# EAGLE schematic light_controller (EAGLE 8.5.0)
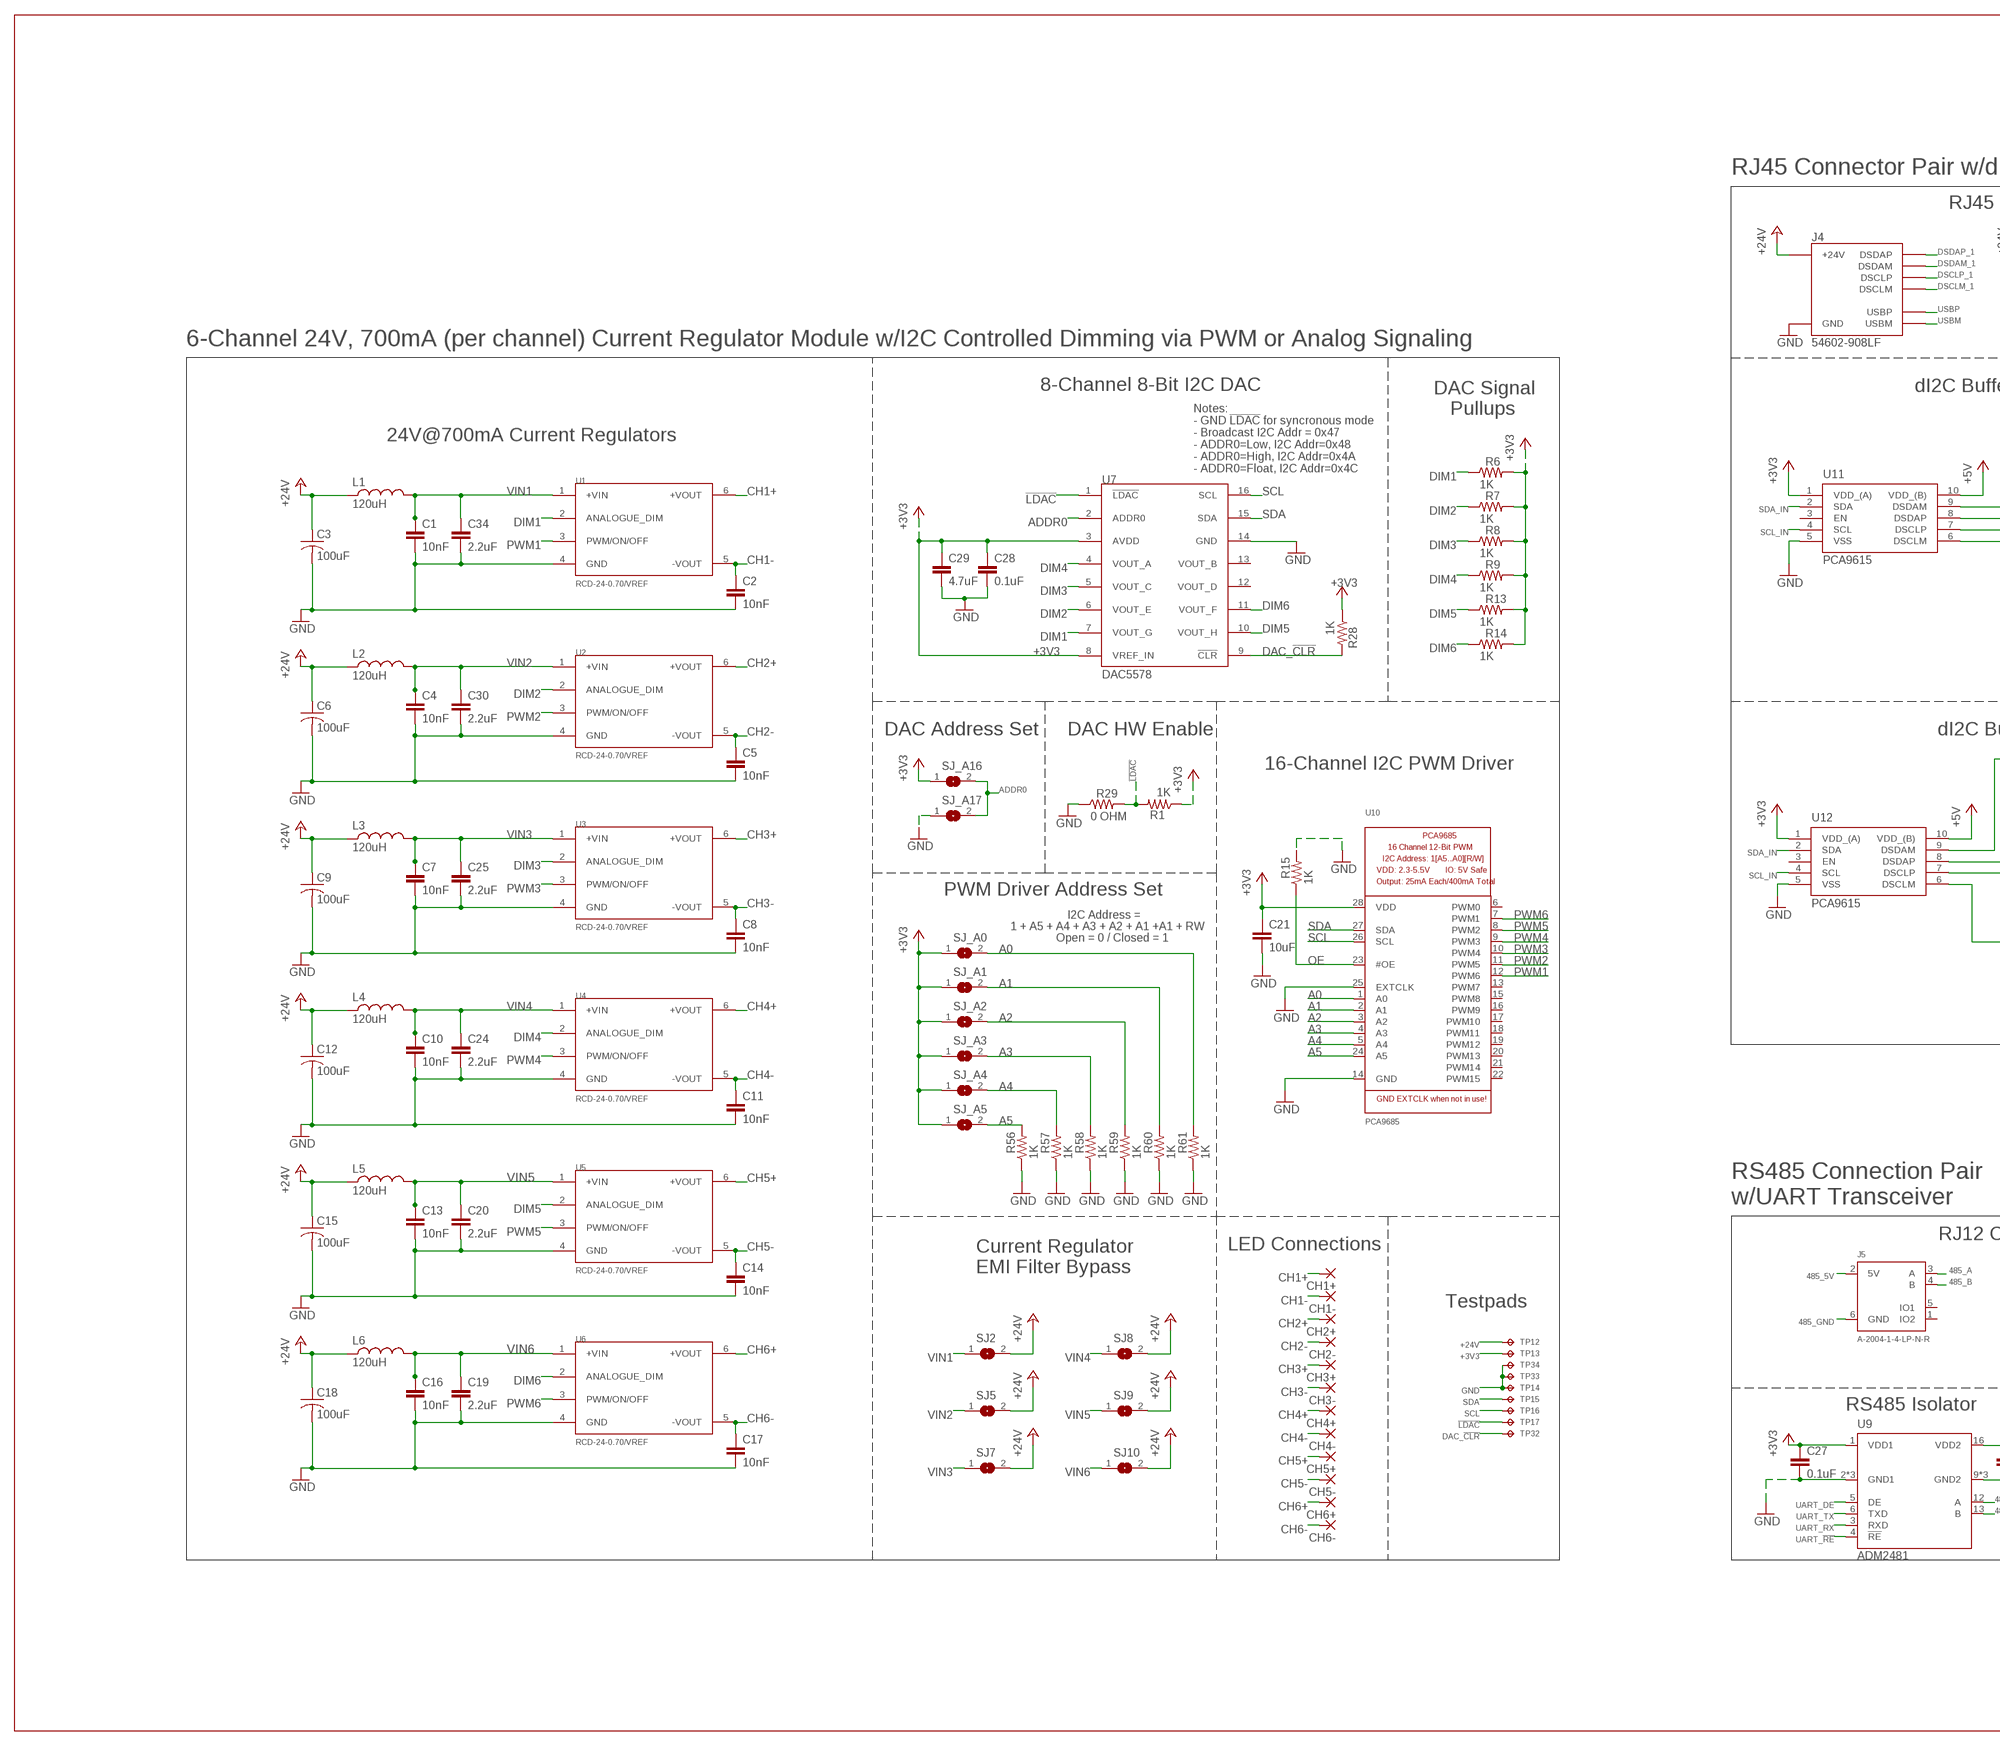
[diagram p0: schematic, sheet 1, part 1 of 2]
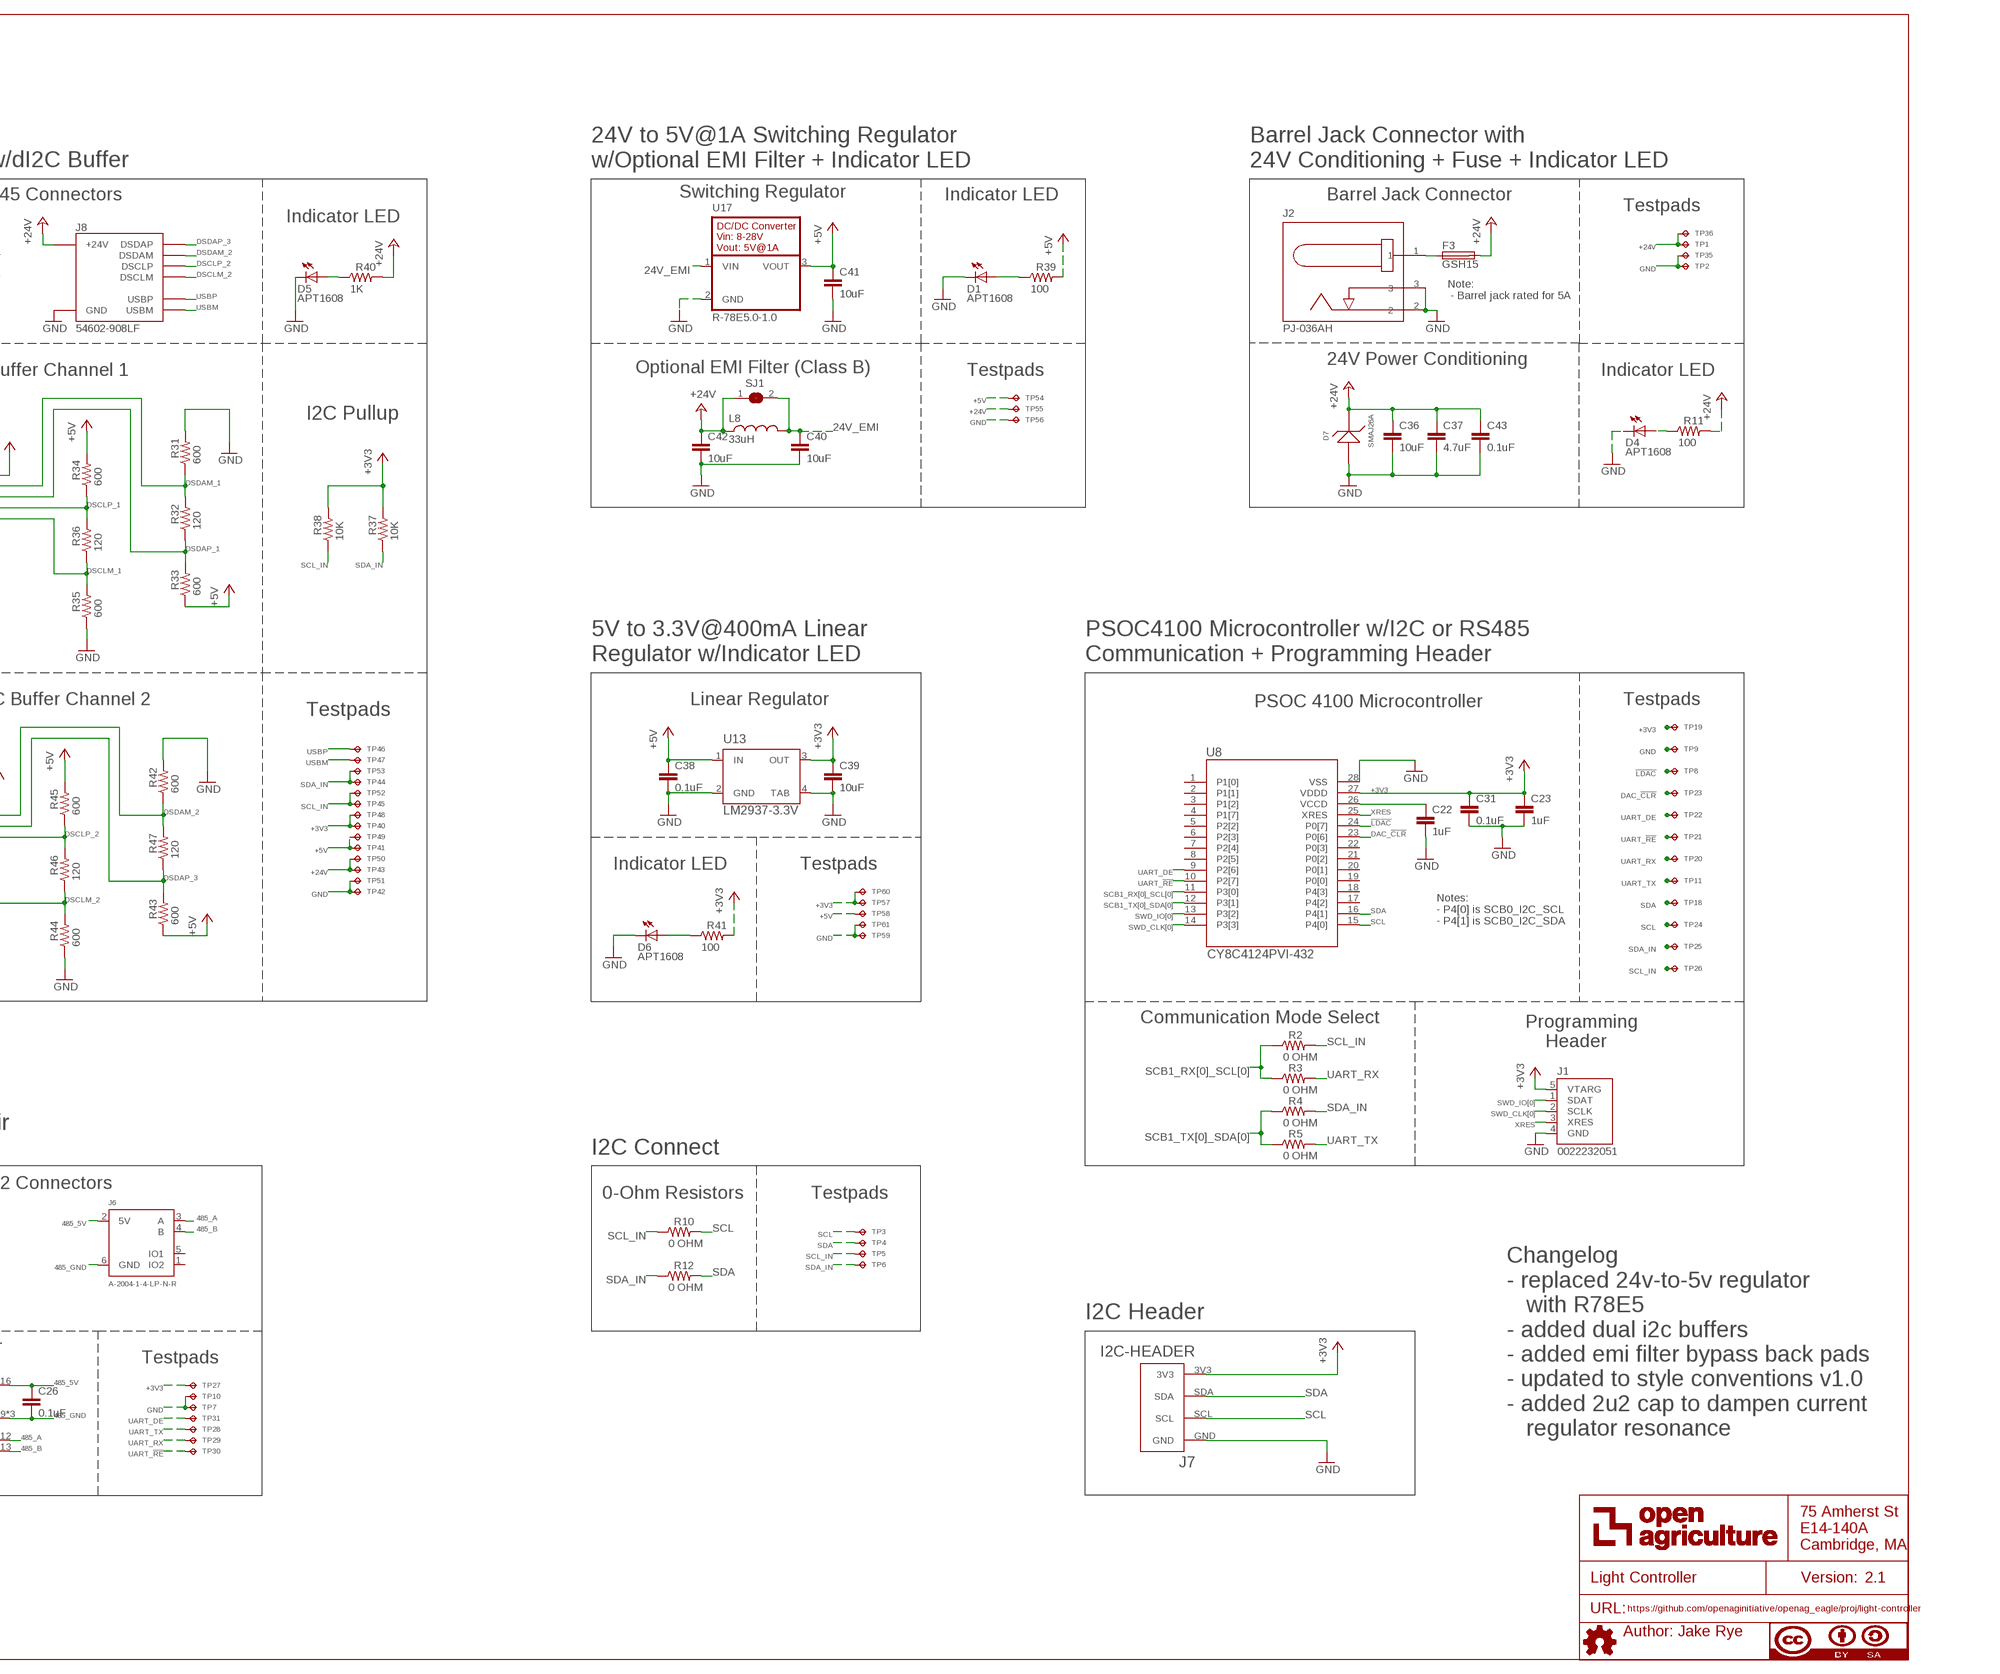
[diagram p1: schematic, sheet 1, part 2 of 2]

## Parts
C1  10nF  10NF-C0603C103K5RACTU  [C0603]
C2  10nF  10NF-C0603C103K5RACTU  [C0603]
C3  100uF  100UF-EEE-1HA101UP  [EEE-1HA101UP]
C4  10nF  10NF-C0603C103K5RACTU  [C0603]
C5  10nF  10NF-C0603C103K5RACTU  [C0603]
C6  100uF  100UF-EEE-1HA101UP  [EEE-1HA101UP]
C7  10nF  10NF-C0603C103K5RACTU  [C0603]
C8  10nF  10NF-C0603C103K5RACTU  [C0603]
C9  100uF  100UF-EEE-1HA101UP  [EEE-1HA101UP]
C10  10nF  10NF-C0603C103K5RACTU  [C0603]
C11  10nF  10NF-C0603C103K5RACTU  [C0603]
C12  100uF  100UF-EEE-1HA101UP  [EEE-1HA101UP]
C13  10nF  10NF-C0603C103K5RACTU  [C0603]
C14  10nF  10NF-C0603C103K5RACTU  [C0603]
C15  100uF  100UF-EEE-1HA101UP  [EEE-1HA101UP]
C16  10nF  10NF-C0603C103K5RACTU  [C0603]
C17  10nF  10NF-C0603C103K5RACTU  [C0603]
C18  100uF  100UF-EEE-1HA101UP  [EEE-1HA101UP]
C19  2.2uF  2.2UF-GRM188R6YA225KA12D  [C0603]
C20  2.2uF  2.2UF-GRM188R6YA225KA12D  [C0603]
C21  10uF  10UF-GMK212BBJ106KG-T  [C0805]
C22  1uF  1UF-CL10A105KB8NNNC  [C0603]
C23  1uF  1UF-CL10A105KB8NNNC  [C0603]
C24  2.2uF  2.2UF-GRM188R6YA225KA12D  [C0603]
C25  2.2uF  2.2UF-GRM188R6YA225KA12D  [C0603]
C26  0.1uF  0.1UF-C0603C104K5RACTU  [C0603]
C27  0.1uF  0.1UF-C0603C104K5RACTU  [C0603]
C28  0.1uF  0.1UF-C0603C104K5RACTU  [C0603]
C29  4.7uF  4.7UF-CL21A475KBQNNNE  [C0805]
C30  2.2uF  2.2UF-GRM188R6YA225KA12D  [C0603]
C31  0.1uF  0.1UF-C0603C104K5RACTU  [C0603]
C34  2.2uF  2.2UF-GRM188R6YA225KA12D  [C0603]
C36  10uF  10UF-GMK212BBJ106KG-T  [C0805]
C37  4.7uF  4.7UF-CL21A475KBQNNNE  [C0805]
C38  0.1uF  0.1UF-C0603C104K5RACTU  [C0603]
C39  10uF  10UF-GMK212BBJ106KG-T  [C0805]
C40  10uF  10UF-GMK212BBJ106KG-T  [C0805]
C41  10uF  10UF-GMK212BBJ106KG-T  [C0805]
C42  10uF  10UF-GMK212BBJ106KG-T  [C0805]
C43  0.1uF  0.1UF-C0603C104K5RACTU  [C0603]
CH1+  3,17/1,3  [3,17/1,3]
CH1-  3,17/1,3  [3,17/1,3]
CH2+  3,17/1,3  [3,17/1,3]
CH2-  3,17/1,3  [3,17/1,3]
CH3+  3,17/1,3  [3,17/1,3]
CH3-  3,17/1,3  [3,17/1,3]
CH4+  3,17/1,3  [3,17/1,3]
CH4-  3,17/1,3  [3,17/1,3]
CH5+  3,17/1,3  [3,17/1,3]
CH5-  3,17/1,3  [3,17/1,3]
CH6+  3,17/1,3  [3,17/1,3]
CH6-  3,17/1,3  [3,17/1,3]
D1  APT1608  APT1608CGCK  [CHIPLED_0603]
D4  APT1608  APT1608CGCK  [CHIPLED_0603]
D5  APT1608  APT1608CGCK  [CHIPLED_0603]
D6  APT1608  APT1608CGCK  [CHIPLED_0603]
D7  SMAJ26A  SMAJ26A-13-F  [SMA]
F3  GSH15  [GSH15]
J1  0022232051  PSOC-PROGRAMMER-0022232051  [PSOC-PROGRAMMER-22-23-2051]
J2  PJ-036AH  BARREL-JACK-PJ-036AH-SMT-TR  [BARREL-JACK-PJ-036AH]
J4  54602-908LF  RJ45-DI2C-USB-54602-908LFPTH  [RJ45-DI2C-USB-54602-908LF]
J5  A-2004-1-4-LP-N-R  RJ12-RS485-A-2004-1-4-LP-N-R  [RJ12-RS485--A-2004-1-4-LP-N-R]
J6  A-2004-1-4-LP-N-R  RJ12-RS485-A-2004-1-4-LP-N-R  [RJ12-RS485--A-2004-1-4-LP-N-R]
J7  I2C-HEADER  HEADER-I2C  [HEADER-I2C]
J8  54602-908LF  RJ45-DI2C-USB-54602-908LFPTH  [RJ45-DI2C-USB-54602-908LF]
L1  120uH  120UH-ASPI-6045S-121M-TCT-ND  [74404064121]
L2  120uH  120UH-ASPI-6045S-121M-TCT-ND  [74404064121]
L3  120uH  120UH-ASPI-6045S-121M-TCT-ND  [74404064121]
L4  120uH  120UH-ASPI-6045S-121M-TCT-ND  [74404064121]
L5  120uH  120UH-ASPI-6045S-121M-TCT-ND  [74404064121]
L6  120uH  120UH-ASPI-6045S-121M-TCT-ND  [74404064121]
L8  33uH  33UH-29333C  [29333C]
R1  1K  1K-ERJ-PB3D1001V  [RC0603N]
R2  0 OHM  0OHM-RC0603JR-070RL  [RC0603N]
R3  0 OHM  0OHM-RC0603JR-070RL  [RC0603N]
R4  0 OHM  0OHM-RC0603JR-070RL  [RC0603N]
R5  0 OHM  0OHM-RC0603JR-070RL  [RC0603N]
R6  1K  1K-ERJ-PB3D1001V  [RC0603N]
R7  1K  1K-ERJ-PB3D1001V  [RC0603N]
R8  1K  1K-ERJ-PB3D1001V  [RC0603N]
R9  1K  1K-ERJ-PB3D1001V  [RC0603N]
R10  0 OHM  0OHM-RC0603JR-070RL  [RC0603N]
R11  100  100OHM-RC0603JR-07100RL  [RC0603N]
R12  0 OHM  0OHM-RC0603JR-070RL  [RC0603N]
R13  1K  1K-ERJ-PB3D1001V  [RC0603N]
R14  1K  1K-ERJ-PB3D1001V  [RC0603N]
R15  1K  1K-ERJ-PB3D1001V  [RC0603N]
R28  1K  1K-ERJ-PB3D1001V  [RC0603N]
R29  0 OHM  0OHM-RC0603JR-070RL  [RC0603N]
R31  600  600OHM-RC0603FR-07604RL  [RC0603N]
R32  120  120OHM-RC0603FR-07120RL  [RC0603N]
R33  600  600OHM-RC0603FR-07604RL  [RC0603N]
R34  600  600OHM-RC0603FR-07604RL  [RC0603N]
R35  600  600OHM-RC0603FR-07604RL  [RC0603N]
R36  120  120OHM-RC0603FR-07120RL  [RC0603N]
R37  10K  10K-ERJ-3EKF1002V  [RC0603N]
R38  10K  10K-ERJ-3EKF1002V  [RC0603N]
R39  100  100OHM-RC0603JR-07100RL  [RC0603N]
R40  1K  1K-ERJ-PB3D1001V  [RC0603N]
R41  100  100OHM-RC0603JR-07100RL  [RC0603N]
R42  600  600OHM-RC0603FR-07604RL  [RC0603N]
R43  600  600OHM-RC0603FR-07604RL  [RC0603N]
R44  600  600OHM-RC0603FR-07604RL  [RC0603N]
R45  600  600OHM-RC0603FR-07604RL  [RC0603N]
R46  120  120OHM-RC0603FR-07120RL  [RC0603N]
R47  120  120OHM-RC0603FR-07120RL  [RC0603N]
R56  1K  1K-ERJ-PB3D1001V  [RC0603N]
R57  1K  1K-ERJ-PB3D1001V  [RC0603N]
R58  1K  1K-ERJ-PB3D1001V  [RC0603N]
R59  1K  1K-ERJ-PB3D1001V  [RC0603N]
R60  1K  1K-ERJ-PB3D1001V  [RC0603N]
R61  1K  1K-ERJ-PB3D1001V  [RC0603N]
SJ1  EMI-BYPASS  [EMI-BYPASS]
SJ2  EMI-BYPASS  [EMI-BYPASS]
SJ5  EMI-BYPASS  [EMI-BYPASS]
SJ7  EMI-BYPASS  [EMI-BYPASS]
SJ8  EMI-BYPASS  [EMI-BYPASS]
SJ9  EMI-BYPASS  [EMI-BYPASS]
SJ10  EMI-BYPASS  [EMI-BYPASS]
SJ_A0  SOLDERJUMPERREFLOW_NOPASTE  [SJ1]
SJ_A1  SOLDERJUMPERREFLOW_NOPASTE  [SJ1]
SJ_A2  SOLDERJUMPERREFLOW_NOPASTE  [SJ1]
SJ_A3  SOLDERJUMPERREFLOW_NOPASTE  [SJ1]
SJ_A4  SOLDERJUMPERREFLOW_NOPASTE  [SJ1]
SJ_A5  SOLDERJUMPERREFLOW_NOPASTE  [SJ1]
SJ_A16  SOLDERJUMPERREFLOW_NOPASTE  [SJ1]
SJ_A17  SOLDERJUMPERREFLOW_NOPASTE  [SJ1]
TP1  TPTP04R  [TP04R]
TP2  TPTP04R  [TP04R]
TP3  TPTP04R  [TP04R]
TP4  TPTP04R  [TP04R]
TP5  TPTP04R  [TP04R]
TP6  TPTP04R  [TP04R]
TP7  TPTP04R  [TP04R]
TP8  TPTP04R  [TP04R]
TP9  TPTP04R  [TP04R]
TP10  TPTP04R  [TP04R]
TP11  TPTP04R  [TP04R]
TP12  TPTP04R  [TP04R]
TP13  TPTP04R  [TP04R]
TP14  TPTP04R  [TP04R]
TP15  TPTP04R  [TP04R]
TP16  TPTP04R  [TP04R]
TP17  TPTP04R  [TP04R]
TP18  TPTP04R  [TP04R]
TP19  TPTP04R  [TP04R]
TP20  TPTP04R  [TP04R]
TP21  TPTP04R  [TP04R]
TP22  TPTP04R  [TP04R]
TP23  TPTP04R  [TP04R]
TP24  TPTP04R  [TP04R]
TP25  TPTP04R  [TP04R]
TP26  TPTP04R  [TP04R]
TP27  TPTP04R  [TP04R]
TP28  TPTP04R  [TP04R]
TP29  TPTP04R  [TP04R]
TP30  TPTP04R  [TP04R]
TP31  TPTP04R  [TP04R]
TP32  TPTP04R  [TP04R]
TP33  TPTP04R  [TP04R]
TP34  TPTP04R  [TP04R]
TP35  TPTP04R  [TP04R]
TP36  TPTP04R  [TP04R]
TP40  TPTP04R  [TP04R]
TP41  TPTP04R  [TP04R]
TP42  TPTP04R  [TP04R]
TP43  TPTP04R  [TP04R]
TP44  TPTP04R  [TP04R]
TP45  TPTP04R  [TP04R]
TP46  TPTP04R  [TP04R]
TP47  TPTP04R  [TP04R]
TP48  TPTP04R  [TP04R]
TP49  TPTP04R  [TP04R]
TP50  TPTP04R  [TP04R]
TP51  TPTP04R  [TP04R]
TP52  TPTP04R  [TP04R]
TP53  TPTP04R  [TP04R]
TP54  TPTP06R  [TP06R]
TP55  TPTP06R  [TP06R]
TP56  TPTP06R  [TP06R]
TP57  TPTP04R  [TP04R]
TP58  TPTP04R  [TP04R]
TP59  TPTP04R  [TP04R]
TP60  TPTP04R  [TP04R]
TP61  TPTP04R  [TP04R]
U1  RCD-24-0.70/VREF  [RCD-24-PINNED]
U2  RCD-24-0.70/VREF  [RCD-24-PINNED]
U3  RCD-24-0.70/VREF  [RCD-24-PINNED]
U4  RCD-24-0.70/VREF  [RCD-24-PINNED]
U5  RCD-24-0.70/VREF  [RCD-24-PINNED]
U6  RCD-24-0.70/VREF  [RCD-24-PINNED]
U7  DAC5578  DAC5578SPW  [TSSOP16]
U8  CY8C4124PVI-432  PSOC4100-CY8C4124PVI-432  [SSOP-28]
U9  ADM2481  ADM2481BRWZ-RL7  [SOIC16LWB]
U10  PCA9685  PCA9685PW/Q900-118  [TSSOP28]
U11  PCA9615  PCA9615DPJ  [SOP50P490X110-10N]
U12  PCA9615  PCA9615DPJ  [SOP50P490X110-10N]
U13  LM2937-3.3V  LM2937IMP-3.3/NOPB  [MP04A]
U17  R-78E5.0-1.0  [R-78E5.0-1.0]
U$6  AUTHOR  [AUTHOR]
U$7  TITLE  [TITLE]

## Nets
24V_EMI: C40.1 L8.2 SJ1.2 U17.1(VIN)
24V_IN: F3.1 J2.1
485_5V: C26.1 J5.2(5V) J6.2(5V) U9.16(VDD2)
485_A: J5.3(A) J6.3(A) U9.12(A)
485_B: J5.4(B) J6.4(B) U9.13(B)
485_GND: C26.2 J5.6(GND) J6.6(GND) U9.9(GND2) U9.10(GND2) U9.15(GND2)
!LDAC!: R1.2 R29.2 TP8.1(TP) TP17.1(TP) U7.1(!LDAC!) U8.24(P0[7])
+3V3: C21.1 C23.1 C27.1 C28.1 C29.1 C31.1 C39.1 J1.5(VTARG) J7.3V3 R1.1 R6.2 R7.2 R8.2 R9.2 R13.2 R14.2 R28.1 R37.2 R38.2 R41.2 SJ_A0.1 SJ_A1.1 SJ_A2.1 SJ_A3.1 SJ_A4.1 SJ_A5.1 SJ_A16.1 TP13.1(TP) TP19.1(TP) TP27.1(TP) TP40.1(TP) TP48.1(TP) TP57.1(TP) TP60.1(TP) U7.3(AVDD) U7.8(VREF_IN) U8.27(VDDD) U9.1(VDD1) U10.28(VDD) U11.1(VDD_(A)) U12.1(VDD_(A)) U13.3(OUT)
+5V: C38.1 C41.1 R33.1 R34.2 R39.2 R43.1 R45.2 TP41.1(TP) TP49.1(TP) TP54.TP TP58.1(TP) U11.10(VDD_(B)) U12.10(VDD_(B)) U13.1(IN) U17.3(VOUT)
+24V: C3.+(1(+)) C6.+(1(+)) C9.+(1(+)) C12.+(1(+)) C15.+(1(+)) C18.+(1(+)) C36.1 C37.1 C42.1 C43.1 D7.1 F3.2 J4.24V(6)(+24V) J8.24V(6)(+24V) L1.1 L2.1 L3.1 L4.1 L5.1 L6.1 L8.1 R11.2 R40.2 SJ1.1 SJ2.2 SJ5.2 SJ7.2 SJ8.2 SJ9.2 SJ10.2 TP1.1(TP) TP12.1(TP) TP36.1(TP) TP43.1(TP) TP50.1(TP) TP55.TP
A0: R61.2 SJ_A0.2 U10.1(A0)
A1: R60.2 SJ_A1.2 U10.2(A1)
A2: R59.2 SJ_A2.2 U10.3(A2)
A3: R58.2 SJ_A3.2 U10.4(A3)
A4: R57.2 SJ_A4.2 U10.5(A4)
A5: R56.2 SJ_A5.2 U10.24(A5)
ADDR0: SJ_A16.2 SJ_A17.2 U7.2(ADDR0)
CH1+: CH1+.1(P) U1.6(+VOUT)
CH1-: C2.1 CH1-.1(P) U1.5(-VOUT)
CH2+: CH2+.1(P) U2.6(+VOUT)
CH2-: C5.1 CH2-.1(P) U2.5(-VOUT)
CH3+: CH3+.1(P) U3.6(+VOUT)
CH3-: C8.1 CH3-.1(P) U3.5(-VOUT)
CH4+: CH4+.1(P) U4.6(+VOUT)
CH4-: C11.1 CH4-.1(P) U4.5(-VOUT)
CH5+: CH5+.1(P) U5.6(+VOUT)
CH5-: C14.1 CH5-.1(P) U5.5(-VOUT)
CH6+: CH6+.1(P) U6.6(+VOUT)
CH6-: C17.1 CH6-.1(P) U6.5(-VOUT)
DAC_!CLR!: R28.2 TP23.1(TP) TP32.1(TP) U7.9(!CLR!) U8.23(P0[6])
DIM1: R6.1 U1.2(ANALOGUE_DIM) U7.7(VOUT_G)
DIM2: R7.1 U2.2(ANALOGUE_DIM) U7.6(VOUT_E)
DIM3: R8.1 U3.2(ANALOGUE_DIM) U7.5(VOUT_C)
DIM4: R9.1 U4.2(ANALOGUE_DIM) U7.4(VOUT_A)
DIM5: R13.1 U5.2(ANALOGUE_DIM) U7.10(VOUT_H)
DIM6: R14.1 U6.2(ANALOGUE_DIM) U7.11(VOUT_F)
DSCLM_1: J4.DSCLM(5)(DSCLM) R35.2 R36.1 U11.6(DSCLM)
DSCLM_2: J8.DSCLM(5)(DSCLM) R44.2 R46.1 U12.6(DSCLM)
DSCLP_1: J4.DSCLP(4)(DSCLP) R34.1 R36.2 U11.7(DSCLP)
DSCLP_2: J8.DSCLP(4)(DSCLP) R45.1 R46.2 U12.7(DSCLP)
DSDAM_1: J4.DSDAM(2)(DSDAM) R31.1 R32.2 U11.9(DSDAM)
DSDAM_2: J8.DSDAM(2)(DSDAM) R42.1 R47.2 U12.9(DSDAM)
DSDAP_1: J4.DSDAP(1)(DSDAP) R32.1 R33.2 U11.8(DSDAP)
DSDAP_3: J8.DSDAP(1)(DSDAP) R43.2 R47.1 U12.8(DSDAP)
GND: C1.2 C2.2 C3.-(2(-)) C4.2 C5.2 C6.-(2(-)) C7.2 C8.2 C9.-(2(-)) C10.2 C11.2 C12.-(2(-)) C13.2 C14.2 C15.-(2(-)) C16.2 C17.2 C18.-(2(-)) C19.2 C20.2 C21.2 C22.2 C23.2 C24.2 C25.2 C27.2 C28.2 C29.2 C30.2 C31.2 C34.2 C36.2 C37.2 C38.2 C39.2 C40.2 C41.2 C42.2 C43.2 D1.C D4.C D5.C D6.C D7.2 J1.4(GND) J2.2 J2.3 J4.GND(3)(GND) J7.GND J8.GND(3)(GND) R15.2 R29.1 R31.2 R35.1 R42.2 R44.1 R56.1 R57.1 R58.1 R59.1 R60.1 R61.1 SJ_A17.1 TP2.1(TP) TP7.1(TP) TP9.1(TP) TP10.1(TP) TP14.1(TP) TP33.1(TP) TP34.1(TP) TP35.1(TP) TP42.1(TP) TP51.1(TP) TP56.TP TP59.1(TP) TP61.1(TP) U1.4(GND) U2.4(GND) U3.4(GND) U4.4(GND) U5.4(GND) U6.4(GND) U7.14(GND) U8.28(VSS) U9.2(GND1) U9.7(GND1) U9.8(GND1) U10.14(GND) U10.25(EXTCLK) U11.5(VSS) U12.5(VSS) U13.2(GND) U13.4(TAB) U17.2(GND)
N$1: D1.A R39.1
N$2: D5.A R40.1
N$3: D6.A R41.1
N$4: D4.A R11.1
N$23: C22.1 U8.26(VCCD)
OE: R15.1 U10.23(#OE)
PWM1: U1.3(PWM/ON/OFF) U10.12(PWM6)
PWM2: U2.3(PWM/ON/OFF) U10.11(PWM5)
PWM3: U3.3(PWM/ON/OFF) U10.10(PWM4)
PWM4: U4.3(PWM/ON/OFF) U10.9(PWM3)
PWM5: U5.3(PWM/ON/OFF) U10.8(PWM2)
PWM6: U6.3(PWM/ON/OFF) U10.7(PWM1)
SCB1_RX[0]_SCL[0]: R2.1 R3.1 U8.11(P3[0])
SCB1_TX[0]_SDA[0]: R4.1 R5.1 U8.12(P3[1])
SCL: J7.SCL R10.2 TP3.1(TP) TP16.1(TP) TP24.1(TP) U7.16(SCL) U8.15(P4[0]) U10.26(SCL)
SCL_IN: R2.2 R10.1 R38.1 TP5.1(TP) TP26.1(TP) TP45.1(TP) TP52.1(TP) U11.4(SCL) U12.4(SCL)
SDA: J7.SDA R12.2 TP4.1(TP) TP15.1(TP) TP18.1(TP) U7.15(SDA) U8.16(P4[1]) U10.27(SDA)
SDA_IN: R4.2 R12.1 R37.1 TP6.1(TP) TP25.1(TP) TP44.1(TP) TP53.1(TP) U11.2(SDA) U12.2(SDA)
SWD_CLK[0]: J1.2(SCLK) U8.14(P3[3])
SWD_IO[0]: J1.1(SDAT) U8.13(P3[2])
UART_!RE!: TP21.1(TP) TP30.1(TP) U8.10(P2[7]) U9.4(!RE!)
UART_DE: TP22.1(TP) TP31.1(TP) U8.9(P2[6]) U9.5(DE)
UART_RX: R3.2 TP20.1(TP) TP29.1(TP) U9.3(RXD)
UART_TX: R5.2 TP11.1(TP) TP28.1(TP) U9.6(TXD)
USBM: J4.USBM(8)(USBM) J8.USBM(8)(USBM) TP47.1(TP)
USBP: J4.USBP(7)(USBP) J8.USBP(7)(USBP) TP46.1(TP)
VIN1: C1.1 C34.1 L1.2 SJ2.1 U1.1(+VIN)
VIN2: C4.1 C30.1 L2.2 SJ5.1 U2.1(+VIN)
VIN3: C7.1 C25.1 L3.2 SJ7.1 U3.1(+VIN)
VIN4: C10.1 C24.1 L4.2 SJ8.1 U4.1(+VIN)
VIN5: C13.1 C20.1 L5.2 SJ9.1 U5.1(+VIN)
VIN6: C16.1 C19.1 L6.2 SJ10.1 U6.1(+VIN)
XRES: J1.3(XRES) U8.25(XRES)
Unconnected: J5.1(IO2) J5.5(IO1) J6.1(IO2) J6.5(IO1) U7.12(VOUT_D) U7.13(VOUT_B) U8.1(P1[0]) U8.2(P1[1]) U8.3(P1[2]) U8.4(P1[7]) U8.5(P2[2]) U8.6(P2[3]) U8.7(P2[4]) U8.8(P2[5]) U8.17(P4[2]) U8.18(P4[3]) U8.19(P0[0]) U8.20(P0[1]) U8.21(P0[2]) U8.22(P0[3]) U10.6(PWM0) U10.13(PWM7) U10.15(PWM8) U10.16(PWM9) U10.17(PWM10) U10.18(PWM11) U10.19(PWM12) U10.20(PWM13) U10.21(PWM14) U10.22(PWM15) U11.3(EN) U12.3(EN)

## Notes on the sheet
- RJ45 Connector Pair w/dI2C Buffer
- 24V to 5V@1A Switching Regulator
  w/Optional EMI Filter + Indicator LED
- Barrel Jack Connector with
  24V Conditioning + Fuse + Indicator LED
- RJ45 Connectors | Switching Regulator | Indicator LED | Barrel Jack Connector
- Testpads
- Indicator LED
- Note:
   - Barrel jack rated for 5A
- 6-Channel 24V, 700mA (per channel) Current Regulator Module w/I2C Controlled Dimming via PWM or Analog Signaling
- 24V Power Conditioning
- 8-Channel 8-Bit I2C DAC | dI2C Buffer Channel 1 | Optional EMI Filter (Class B) | Testpads | Indicator LED
- DAC Signal 
     Pullups
- 24V@700mA Current Regulators | I2C Pullup
- Notes:
  - GND !LDAC! for syncronous mode
  - Broadcast I2C Addr = 0x47
  - ADDR0=Low, I2C Addr=0x48
  - ADDR0=High, I2C Addr=0x4A
  - ADDR0=Float, I2C Addr=0x4C
- 5V to 3.3V@400mA Linear 
  Regulator w/Indicator LED
- PSOC4100 Microcontroller w/I2C or RS485 
  Communication + Programming Header
- DAC Address Set | DAC HW Enable | dI2C Buffer Channel 2 | Linear Regulator | PSOC 4100 Microcontroller | Testpads
- Testpads
- 16-Channel I2C PWM Driver
- PWM Driver Address Set
- Indicator LED | Testpads
- I2C Address =
- 1 + A5 + A4 + A3 + A2 + A1 +A1 + RW
- Open = 0 / Closed = 1
- Notes:
  - P4[0] is SCB0_I2C_SCL
  - P4[1] is SCB0_I2C_SDA
- Communication Mode Select
- Programming 
      Header
- RS485 Connection Pair 
  w/UART Transceiver
- I2C Connect
- RJ12 Connectors
- LED Connections | 0-Ohm Resistors | Testpads
- Current Regulator 
  EMI Filter Bypass
- Testpads
- I2C Header
- RS485 Isolator
- Testpads
- Changelog
  - replaced 24v-to-5v regulator 
     with R78E5
  - added dual i2c buffers
  - added emi filter bypass back pads
  - updated to style conventions v1.0
  - added 2u2 cap to dampen current 
     regulator resonance

## Library data of the parts
C1 C2 C4 C5 C7 C8 C10 C11 C13 C14 C16 C17 = openag-capacitors:10NF-C0603C103K5RACTU: CAP CER 10000PF 50V X7R 0603 Description: 10000pF ±10% 50V Ceramic Capacitor X7R 0603 (1608 Metric) Technical Specifications: Capacitance: 10000pF Tolerance: ±10% Voltage - Rated: 50V Temperature Coefficient: X7R Operating Temperature: -55°C ~ 125°C Applications: General Purpose Mounting Type: Surface Mount, MLCC Package / Case: 0603 (1608 Metric) Size / Dimension: 0.063" L x 0.032" W (1.60mm x 0.80mm) Thickness (Max): 0.034" (0.87mm) Datasheet(s): X7R Dielectric, 6.3-250 VDC <https://search.kemet.com/component-edge/download/datasheet/C0603C103K5RACTU.pdf> Vendor(s): Digikey: 399-1091-1-ND <https://www.digikey.com/product-detail/en/kemet/C0603C103K5RACTU/399-1091-1-ND/411366#>; MANUFACTURER: KEMET; MPN: C0603C103K5RACTU; VENDOR: Digikey; VLINK: https://www.digikey.com/product-detail/en/kemet/C0603C103K5RACTU/399-1091-1-ND/411366#; VPN: 399-1091-1-ND
C3 C6 C9 C12 C15 C18 = openag-capacitors:100UF-EEE-1HA101UP: CAP ALUM 100UF 20% 50V SMD Description: 100µF 50V Aluminum Electrolytic Capacitors Radial, Can - SMD 2000 Hrs @ 85°C Technical Specifications: Capacitance: 100µF Tolerance: ±20% Voltage - Rated: 50V Lifetime @ Temp.: 2000 Hrs @ 85°C Operating Temperature: -40°C ~ 85°C Polarization: Polar Ratings: AEC-Q200 Applications: Automotive Ripple Current @ Low Frequency: 200mA @ 120Hz Ripple Current @ High Frequency: 340mA @ 10kHz Size / Dimension: 0.315" Dia (8.00mm) Height - Seated (Max): 0.402" (10.20mm) Surface Mount Land Size: 0.327" L x 0.327" W (8.30mm x 8.30mm) Mounting Type: Surface Mount Package / Case: Radial, Can - SMD Datasheet(s): S Series, Type V <https://industrial.panasonic.com/cdbs/www-data/pdf/RDE0000/ABA0000C1145.pdf> Aluminum Electrolytic Cap Part Numbering System <https://industrial.panasonic.com/cdbs/www-data/pdf/RDE0000/DME0000COL90.pdf> Vendor(s): Digikey: PCE3917CT-ND <https://www.digikey.com/product-detail/en/panasonic-electronic-components/EEE-1HA101UP/PCE3917CT-ND/766293>; MANUFACTURER: Panasonic Electronic Components; MPN: EEE-1HA101UP; VENDOR: Digikey; VLINK: https://www.digikey.com/product-detail/en/panasonic-electronic-components/EEE-1HA101UP/PCE3917CT-ND/766293; VPN: PCE3917CT-ND
C19 C20 C24 C25 C30 C34 = openag-capacitors:2.2UF-GRM188R6YA225KA12D: CAP CER 2.2UF 35V X5R 0603 Description: 2.2µF ±10% 35V Ceramic Capacitor X5R 0603 (1608 Metric) Technical Specifications: Capacitance: 2.2µF Tolerance: ±10% Voltage - Rated: 35V Temperature Coefficient: X5R Operating Temperature: -55°C ~ 85°C Applications: General Purpose Mounting Type: Surface Mount, MLCC Package / Case: 0603 (1608 Metric) Size / Dimension: 0.063" L x 0.032" W (1.60mm x 0.80mm) Thickness (Max): 0.035" (0.90mm) Datasheet(s): Chip Monolithic Ceramic Caps Catalog <https://www.murata.com/~/media/webrenewal/support/library/catalog/products/capacitor/mlcc/c02e.ashx> Chip Monolithic Ceramic Caps Part Numbering <https://search.murata.co.jp/Ceramy/image/img/A01X/partnumbering_e_01.pdf> Specifications and Test Methods 3p <http://search.murata.co.jp/Ceramy/image/img/A01X/C1606E.pdf> GRM188R6YA225KA12 Ref Sheet <http://search.murata.co.jp/Ceramy/image/img/A01X/G101/ENG/GRM188R6YA225KA12-01.pdf> Vendor(s): Digikey: 490-7204-1-ND <https://www.digikey.com/product-detail/en/murata-electronics-north-america/GRM188R6YA225KA12D/490-7204-1-ND/3900456>; MANUFACTURER: Murata Electronics North America; MPN: GRM188R6YA225KA12D; VENDOR: Digikey; VLINK: https://www.digikey.com/product-detail/en/murata-electronics-north-america/GRM188R6YA225KA12D/490-7204-1-ND/3900456; VPN: 490-7204-1-ND
C21 C36 C39-C42 = openag-capacitors:10UF-GMK212BBJ106KG-T: CAP CER 10UF 35V X5R 0805 Description: 10µF ±10% 35V Ceramic Capacitor X5R 0805 (2012 Metric) Technical Specifications: Capacitance: 10µF Tolerance: ±10% Rated Voltage: 35V Temperature Coefficient: X5R Operating Temperature: -55°C ~ 85°C Package / Case: 0805 (2012 Metric) Datasheet(s): GMK212BBJ106KG-T Spec <http://ds.yuden.co.jp/TYCOMPAS/ut/detail.do?productNo=GMK212BBJ106KG-T&fileName=GMK212BBJ106KG-T_SS&mode=specSheetDownload> Vendor(s): Digikey: 587-4893-1-ND <https://www.digikey.com/product-detail/en/taiyo-yuden/GMK212BBJ106KG-T/587-4893-1-ND/6563736>; MANUFACTURER: Taiyo Yuden; MPN: GMK212BBJ106KG-T; VENDOR: Digikey; VLINK: https://www.digikey.com/product-detail/en/taiyo-yuden/GMK212BBJ106KG-T/587-4893-1-ND/6563736; VPN: 587-4893-1-ND
C22 C23 = openag-capacitors:1UF-CL10A105KB8NNNC: CAP CER 1UF 50V X5R 0603 Description: 1µF ±10% 50V Ceramic Capacitor X5R 0603 (1608 Metric) Technical Specifications: Capacitance: 1µF Tolerance: ±10% Voltage - Rated: 50V Temperature Coefficient: X5R Operating Temperature: -55°C ~ 85°C Applications: General Purpose Mounting Type: Surface Mount, MLCC Package / Case: 0603 (1608 Metric) Size / Dimension: 0.063" L x 0.032" W (1.60mm x 0.80mm) Thickness (Max): 0.035" (0.90mm) Datasheet(s): CL10A105KB8NNNC Spec <http://www.samsungsem.com/kr/support/product-search/mlcc/CL10A105KB8NNNC.jsp> CL10A105KB8NNNC Characteristics <http://www.samsungsem.com/kr/front/downloadcms.do?path=/kr/support/product-search/mlcc/__icsFiles/afieldfile/2014/11/05&fileName=C_CL10A105KB8NNNC.pdf> MLCC Catalog <http://www.samsungsem.com/kr/support/library/product-catalog/mlcc.jsp> Vendor(s): Digikey: 1276-1860-1-ND <https://www.digikey.com/product-detail/en/samsung-electro-mechanics-america-inc/CL10A105KB8NNNC/1276-1860-1-ND/3889946>; MANUFACTURER: Samsung Electro-Mechanics; MPN: CL10A105KB8NNNC; VENDOR: Digikey; VLINK: https://www.digikey.com/product-detail/en/samsung-electro-mechanics-america-inc/CL10A105KB8NNNC/1276-1860-1-ND/3889946; VPN: 1276-1860-1-ND
C26-C28 C31 C38 C43 = openag-capacitors:0.1UF-C0603C104K5RACTU: Kemet - C0603C104K5RACTU - CAP CER 0.1UF 50V X7R 0603 Description: 0.1µF ±10% 50V Ceramic Capacitor X7R 0603 (1608 Metric) Technical Specifications: Capacitance: 0.1µF Tolerance: ±10% Rated Voltage: 50V Temperature Coefficient: X7R Operating Temperature: -55°C ~ 125°C Package / Case: 0603 (1608 Metric) Datasheet(s): X7R Dielectric, 6.3-250 VDC <https://search.kemet.com/component-edge/download/datasheet/C0603C104K5RACTU.pdf> Vendor(s): Digikey: 399-5089-1-ND <https://www.digikey.com/product-detail/en/kemet/C0603C104K5RACTU/399-5089-1-ND/1465623>; POPULATE: YES; VERIFIED: NO
C29 C37 = openag-capacitors:4.7UF-CL21A475KBQNNNE: Samsung - CL21A475KBQNNNE - CAP CER 4.7UF 50V X5R 0805 Description: 4.7µF ±10% 50V Ceramic Capacitor X5R 0805 (2012 Metric) Technical Specifications: Capacitance: 4.7uF Tolerance: ±10% Rated Voltage: 50V Temperature Coefficient: X5R Operating Temperature: -55°C ~ 85°C Package/Case: 0805 (2012 Metric) Datasheet(s): CL21A475KBQNNNE Characteristics <http://www.samsungsem.com/kr/front/downloadcms.do?path=/kr/support/product-search/mlcc/__icsFiles/afieldfile/2014/11/05&fileName=C_CL21A475KBQNNNE.pdf> Vendor(s): Digikey: 1276-1248-1-ND <https://www.digikey.com/product-detail/en/samsung-electro-mechanics/CL21A475KBQNNNE/1276-1248-1-ND/3889334>; POPULATE: YES; VERIFIED: NO
CH1+ CH1- CH2+ CH2- CH3+ CH3- CH4+ CH4- CH5+ CH5- CH6+ CH6- = openag-wirepads:3,17/1,3: THROUGH-HOLE PAD; MPN: N/A
D1 D4-D6 = openag-diodes:APT1608CGCK: LED GREEN CLEAR 0603 SMD Description: Green 570nm LED Indication - Discrete 2.1V 0603 (1608 Metric) Technical Specifications: Color: Green Lens Color: Colorless Lens Transparency: Clear Millicandela Rating: 50mcd Lens Style/Size: Rectangle with Flat Top, 1.20mm x 0.80mm Voltage - Forward (Vf) (Typ): 2.1V Current - Test: 20mA Viewing Angle: 120° Mounting Type: Surface Mount Wavelength - Dominant: 570nm Wavelength - Peak: 574nm Package / Case: 0603 (1608 Metric) Supplier Device Package: Chip LED Size / Dimension: 1.60mm L x 0.80mm W Height (Max): 0.75mm Datasheet(s): APT1608CGCK <http://www.kingbrightusa.com/images/catalog/SPEC/APT1608CGCK.pdf> Vendor(s): Digikey: 754-1116-1-ND <https://www.digikey.com/product-detail/en/kingbright/APT1608CGCK/754-1116-1-ND/1747833#>; MANUFACTURER: Kingbright; MPN: APT1608CGCK; VENDOR: Digikey; VLINK: https://www.digikey.com/product-detail/en/kingbright/APT1608CGCK/754-1116-1-ND/1747833#; VPN: 754-1116-1-ND
D7 = openag-diodes:SMAJ26A-13-F: TVS DIODE 26VWM 42.1VC SMA Description: TVS DIODE 26VWM 42.1VC SMA Technical Specifications: Type: Zener Voltage - Reverse Standoff (Typ): 26V Voltage - Breakdown (Min): 28.9V Voltage - Clamping (Max) @ Ipp: 42.1V Current - Peak Pulse (10/1000µs): 9.5A Power - Peak Pulse: 400W Power Line Protection: No Operating Temperature: -55°C ~ 150°C (TJ) DO-214AC, SMA Datasheet(s): SMAJ5.0(C)A - SMAJ200(C)A Vendor(s): Digikey: SMAJ26A-FDICT-ND <https://www.digikey.com/product-detail/en/diodes-incorporated/SMAJ26A-13-F/SMAJ26A-FDICT-ND/806583>; MANUFACTURER: Diodes Incorporated; MPN: SMAJ26A-13-F; VENDOR: Digikey; VLINK: https://www.digikey.com/product-detail/en/diodes-incorporated/SMAJ26A-13-F/SMAJ26A-FDICT-ND/806583; VPN: SMAJ26A-FDICT-ND
F3 = openag-fuses:GSH15: FUSE BLOCK CART 250V 6.3A PCB Description: Fuse Block 6.3A 250V 1 Circuit Cartridge PCB Technical Specifications: Fuseholder Type: Block Fuse Type: Cartridge For Use With/Related Products: 5mm x 20mm Fuse Size: 5mm x 20mm Number of Circuits: 1 Voltage: 250V Current Rating: 6.3A Mounting Type: PCB Orientation: Horizontal Termination Style: PC Pin Contact Material: Copper Alloy Contact Finish: Tin Datasheet(s): 649 Series <http://www.littelfuse.com/~/media/electronics/datasheets/fuse_blocks/littelfuse_fuse_block_649_datasheet.pdf.pdf> Vendor(s): Digikey: WK0011-ND <https://www.digikey.com/product-detail/en/littelfuse-inc/64900001039/WK0011-ND/245470>; MANUFACTURER: Littelfuse Inc.; MPN: 64900001039; VENDOR: Digikey; VLINK: https://www.digikey.com/product-detail/en/littelfuse-inc/64900001039/WK0011-ND/245470; VPN: WK0011-ND
J1 = openag-connectors:PSOC-PROGRAMMER-0022232051: CONN HEADER 5POS .100 VERT TIN Description: 5 Positions Header Connector 0.100" (2.54mm) Through Hole Tin This is the specified mating connector for programming a PSOC microcontroller with the MiniProg3 Programmer Technical Specifications: Connector Type: Header Contact Type: Male Pin Pitch - Mating: 0.100" (2.54mm) Number of Positions: 5 Number of Rows: 1 Mounting Type: Through Hole Fastening Type: Friction Lock Datasheet(s): Molex 22-23-2051 <http://www.molex.com/pdm_docs/sd/022232051_sd.pdf> Cypress CY8CKIT-002 Brief <http://www.cypress.com/file/44091/download> Vendor(s): Digikey: WM4203-ND (Molex Connector) <https://www.digikey.com/product-detail/en/molex-llc/0022232051/WM4203-ND/26673> Digikey: 428-2975-ND (Cypress Programmer Kit) <https://www.digikey.com/product-detail/en/cypress-semiconductor-corp/CY8CKIT-002/428-2975-ND/2126344>; MANUFACTURER: Molex; MPN: 0022232051; VENDOR: Digikey; VLINK: https://www.digikey.com/product-detail/en/molex-llc/0022232051/WM4203-ND/26673; VPN: WM4203-ND
J2 = openag-connectors:BARREL-JACK-PJ-036AH-SMT-TR: CONN PWR JACK 2X5.5MM SOLDER Description: Power Barrel Connector Jack 2.10mm ID (0.083"), 5.50mm OD (0.217") Surface Mount, Right Angle Technical Specifications: Connector Type: Jack Gender: Male Industry Recognized Mating Diameter: 2.10mm ID (0.083"), 5.50mm OD (0.217") Actual Diameter: 0.078" (2.00mm ID), 0.248" (6.30mm OD) Number of Positions/Contacts: 2 Conductors, 3 Contacts Internal Switch(s): Single Switch, Normally Closed Mounting Type: Surface Mount, Right Angle Termination: Solder Shielding: Unshielded Voltage - Rated: 24VDC Current Rating: 5A Mating Length/Depth: 0.360" (9.15mm) Contact Material - Plating: Silver Operating Temperature: -25°C ~ 85°C Housing Material: Polyamide (PA6T), Nylon 6T Contact Material: Brass; Copper Alloy Body Color: Black Datasheet(s): PJ-036AH-SMT-TR <http://www.cui.com/product/resource/digikeypdf/pj-036ah-smt-tr.pdf> Vendor(s): Digikey: CP-036AHPJCT-ND <https://www.digikey.com/product-detail/en/cui-inc/PJ-036AH-SMT-TR/CP-036AHPJCT-ND/1530994>; MANUFACTURER: CUI Inc.; MPN: PJ-036AH-SMT-TR; VENDOR: Digikey; VLINK: https://www.digikey.com/product-detail/en/cui-inc/PJ-036AH-SMT-TR/CP-036AHPJCT-ND/1530994; VPN: CP-036AHPJCT-ND
J4 J8 = openag-connectors:RJ45-DI2C-USB-54602-908LF: CONN MOD JACK 8P8C R/A UNSHLD Description: Jack Modular Connector 8p8c (RJ45, Ethernet) 90° Angle (Right) Unshielded Cat3 Technical Specifications: Connector Type: Jack Number of Positions/Contacts: 8p8c (RJ45, Ethernet) Number of Ports: 1 Number of Rows: 1 Mounting Type: Through Hole Orientation: 90° Angle (Right) Termination: Solder Shielding: Unshielded Ratings: Cat3 Features: Board Lock LED Color: Does Not Contain LED Tab Direction: Down Contact Material: Copper Alloy Contact Finish: Gold Contact Finish Thickness: 15µin (0.38µm) Housing Material: Polyester, Glass Filled Operating Temperature: -40°C ~ 70°C Datasheet(s): 54601-x04(zzz)WPLF Drawing <http://cdn.amphenol-icc.com/media/wysiwyg/files/drawing/c-bmj-0102.pdf> Vendor(s): Digikey: 609-1046-ND <https://www.digikey.com/product-detail/en/amphenol-fci/54602-908LF/609-1046-ND/1001360>; MANUFACTURER: Amphenol FCI; MPN: 54602-908LF; VENDOR: Digikey; VLINK: https://www.digikey.com/product-detail/en/amphenol-fci/54602-908LF/609-1046-ND/1001360; VPN: 609-1046-ND
J5 J6 = openag-connectors:RJ12-RS485-A-2004-1-4-LP-N-R: RJ12 CONN MOD JACK 6P6C R/A UNSHLD Description: Jack Modular Connector 6p6c (RJ11, RJ12, RJ14, RJ25) 90° Angle (Right) Unshielded Technical Specifications: Connector Type: Jack Number of Positions/Contacts: 6p6c (RJ11, RJ12, RJ14, RJ25) Number of Ports: 1 Number of Rows: 1 Mounting Type: Through Hole Orientation: 90° Angle (Right) Termination: Solder Shielding: Unshielded Features: Board Lock LED Color: Does Not Contain LED Tab Direction: Down Contact Material: Phosphor Bronze Contact Finish: Gold Contact Finish Thickness: 6µin (0.152µm) Housing Material: Polybutylene Terephthalate (PBT), Glass Filled Operating Temperature: -40°C ~ 85°C Datasheet(s): A-2004-1-4-LP-N Drawing <http://www.assmann-wsw.com/fileadmin/datasheets/ASS_7320_CO.pdf> Vendor(s): Digikey: AE10383-ND <https://www.digikey.com/product-detail/en/assmann-wsw-components/A-2004-1-4-LP-N-R/AE10383-ND/2183634>; MANUFACTURER: Assmann WSW Components; MPN: A-2004-1-4-LP-N-R; VENDOR: Digikey; VLINK: https://www.digikey.com/product-detail/en/assmann-wsw-components/A-2004-1-4-LP-N-R/AE10383-ND/2183634; VPN: AE10383-ND
J7 = openag-connectors:HEADER-I2C: 100 MIL HEADER I2C CONNECTIONS; MPN: N/A
L1-L6 = openag-inductors:120UH-ASPI-6045S-121M-TCT-ND: FIXED IND 120UH 700MA 484 MOHM Description: 120µH Shielded Wirewound Inductor 700mA 484 mOhm Nonstandard Technical Specifications: Type: Wirewound Material - Core: Ferrite Inductance: 120µH Tolerance: ±20% Current Rating: 700mA Current - Saturation: 850mA Shielding: Shielded DC Resistance (DCR): 484 mOhm Frequency - Self Resonant: 4.2MHz Operating Temperature: -40°C ~ 125°C Frequency - Test: 100kHz Mounting Type: Surface Mount Package / Case: Nonstandard Size / Dimension: 0.236" L x 0.236" W (6.00mm x 6.00mm) Height - Seated (Max): 0.177" (4.50mm) Datasheet(s): ASPI-6045S Series Datasheet <http://www.abracon.com/Magnetics/power/ASPI-6045S.pdf> ASPI-6045S Drawing <http://www.abracon.com/Support/PackageDrawing/Magnetics/ASPI-6045S.PDF> Vendor(s): Digikey: ASPI-6045S-121M-TCT-ND <https://www.digikey.com/products/en?keywords=ASPI-6045S-121M-TCT-ND%09>; MANUFACTURER: Abracon LLC; MPN: ASPI-6045S-121M-T; VENDOR: Digikey; VLINK: https://www.digikey.com/products/en?keywords=ASPI-6045S-121M-TCT-ND%09; VPN: ASPI-6045S-121M-TCT-ND
L8 = openag-inductors:33UH-29333C: FIXED IND 33UH 1A 120 MOHM SMD Description: 33µH Shielded Wirewound Inductor 1A 120 mOhm Max Nonstandard Technical Specifications: Type: Wirewound Inductance: 33µH Current Rating: 1A Shielding: Shielded DC Resistance (DCR): 120 mOhm Max Operating Temperature: -40°C ~ 85°C Frequency - Test: 10kHz Mounting Type: Surface Mount Package / Case: Nonstandard Size / Dimension: 0.283" L x 0.283" W (7.20mm x 7.20mm) Height - Seated (Max): 0.157" (4.00mm) Datasheet(s): 2900 Series <https://www.murata-ps.com/data/magnetics/kmp_2900.pdf> Vendor(s): Digikey: 811-1138-1-ND <https://www.digikey.com/product-detail/en/murata-power-solutions-inc/29333C/811-1138-1-ND/1924860>; MANUFACTURER: Murata Power Solutions Inc.; MPN: 29333C; VENDOR: Digikey; VLINK: https://www.digikey.com/product-detail/en/murata-power-solutions-inc/29333C/811-1138-1-ND/1924860; VPN: 811-1138-1-ND
R1 R6-R9 R13-R15 R28 R40 R56-R61 = openag-resistors:1K-ERJ-PB3D1001V: RES SMD 1K OHM 0.5% 1/5W 0603 Description: 1 kOhms ±0.5% 0.2W, 1/5W Chip Resistor 0603 (1608 Metric) Automotive AEC-Q200, Pulse Withstanding Thick Film Technical Specifications: Resistance: 1 kOhms Tolerance: ±0.5% Power: 0.2W, 1/5W Operating Temperature: -55°C ~ 155°C Package / Case: 0603 (1608 Metric) Datasheet(s): ERJ-PB3, PB6 Series, High Precision Datasheet <https://industrial.panasonic.com/cdbs/www-data/pdf/RDM0000/AOA0000C328.pdf> Vendor(s): Digikey: P20283CT-ND <https://www.digikey.com/product-detail/en/panasonic-electronic-components/ERJ-PB3D1001V/P20283CT-ND/6214538>; MANUFACTURER: Panasonic; MPN: P20283CT-ND; VENDOR: Digikey; VLINK: https://www.digikey.com/product-detail/en/panasonic-electronic-components/ERJ-PB3D1001V/P20283CT-ND/6214538; VPN: P20283CT-ND
R2-R5 R10 R12 R29 = openag-resistors:0OHM-RC0603JR-070RL: RES SMD 0 OHM JUMPER 1/10W 0603 Description: 0 Ohms Jumper 0.1W, 1/10W Chip Resistor 0603 (1608 Metric) Moisture Resistant Thick Film Technical Specifications: Resistance: 0 Ohms Power: 0.1W, 1/10W Operating Temperature: -55°C ~ 155°C Package / Case: 0603 (1608 Metric) Datasheet(s): RC Series, L Datasheet <http://www.yageo.com/documents/recent/PYu-RC_Group_51_RoHS_L_8.pdf> Vendor(s): Digikey: 311-0.0GRCT-ND <https://www.digikey.com/product-detail/en/yageo/RC0603JR-070RL/311-0.0GRCT-ND/729622>; MANUFACTURER: Yageo; MPN: RC0603JR-070RL; VENDOR: Digikey; VLINK: https://www.digikey.com/product-detail/en/yageo/RC0603JR-070RL/311-0.0GRCT-ND/729622; VPN: 311-0.0GRCT-ND
R11 R39 R41 = openag-resistors:100OHM-RC0603JR-07100RL: RES SMD 100 OHM 5% 1/10W 0603 Description: 100 Ohms ±5% 0.1W, 1/10W Chip Resistor 0603 (1608 Metric) Moisture Resistant Thick Film Technical Specifications: Resistance: 100 Ohms Tolerance: ±5% Power (Watts): 0.1W, 1/10W Composition: Thick Film Features: Moisture Resistant Temperature Coefficient: ±100ppm/°C Operating Temperature: -55°C ~ 155°C Package / Case: 0603 (1608 Metric) Supplier Device Package: 0603 Size / Dimension: 0.063" L x 0.032" W (1.60mm x 0.80mm) Height - Seated (Max): 0.022" (0.55mm) Number of Terminations: 2 Datasheet(s): Thick Film Chip Resistor Intro <http://www.yageo.com.tw/exep/pages/download/literatures/PYu-R_INT-thick_7.pdf> Chip Resistor Marking <http://www.yageo.com/exep/pages/download/literatures/PYu-R_Marking_2.pdf> RC Series, L Datasheet <http://www.yageo.com/documents/recent/PYu-RC_Group_51_RoHS_L_8.pdf> Vendor(s): Digikey: 311-100GRCT-ND <https://www.digikey.com/product-detail/en/yageo/RC0603JR-07100RL/311-100GRCT-ND/729644>; MANUFACTURER: Yageo; MPN: RC0603JR-07100RL; VENDOR: Digikey; VLINK: https://www.digikey.com/product-detail/en/yageo/RC0603JR-07100RL/311-100GRCT-ND/729644; VPN: 311-100GRCT-ND
R31 R33-R35 R42-R45 = openag-resistors:600OHM-RC0603FR-07604RL: RES SMD 604 OHM 1% 1/10W 0603 Description: 604 Ohms ±1% 0.1W, 1/10W Chip Resistor 0603 (1608 Metric) Moisture Resistant Thick Film Technical Specifications: Resistance: 604 Ohms Tolerance: ±1% Power (Watts): 0.1W, 1/10W Composition: Thick Film Features: Moisture Resistant Temperature Coefficient: ±100ppm/°C Operating Temperature: -55°C ~ 155°C Package / Case: 0603 (1608 Metric) Supplier Device Package: 0603 Size / Dimension: 0.063" L x 0.032" W (1.60mm x 0.80mm) Height - Seated (Max): 0.022" (0.55mm) Number of Terminations: 2 Datasheet(s): RC Series, L Datasheet <http://www.yageo.com/documents/recent/PYu-RC_Group_51_RoHS_L_8.pdf> Chip Resistor Marking <http://www.yageo.com/exep/pages/download/literatures/PYu-R_Marking_2.pdf> Vendor(s): Digikey: 311-604HRCT-ND <https://www.digikey.com/product-detail/en/yageo/RC0603FR-07604RL/311-604HRCT-ND/730276>; MANUFACTURER: Yageo; MPN: RC0603FR-07604RL; VENDOR: Digikey; VLINK: https://www.digikey.com/product-detail/en/yageo/RC0603FR-07604RL/311-604HRCT-ND/730276; VPN: 311-604HRCT-ND
R32 R36 R46 R47 = openag-resistors:120OHM-RC0603FR-07120RL: RES SMD 120 OHM 1% 1/10W 0603 Description: 120 Ohms ±1% 0.1W, 1/10W Chip Resistor 0603 (1608 Metric) Moisture Resistant Thick Film Technical Specifications: Resistance: 120 Ohms Tolerance: ±1% Power (Watts): 0.1W, 1/10W Composition: Thick Film Features: Moisture Resistant Temperature Coefficient: ±100ppm/°C Operating Temperature: -55°C ~ 155°C Package / Case: 0603 (1608 Metric) Supplier Device Package: 0603 Size / Dimension: 0.063" L x 0.032" W (1.60mm x 0.80mm) Height - Seated (Max): 0.022" (0.55mm) Number of Terminations: 2 Datasheet(s): RC Series, L Datasheet <http://www.yageo.com/documents/recent/PYu-RC_Group_51_RoHS_L_8.pdf> Chip Resistor Marking <http://www.yageo.com/exep/pages/download/literatures/PYu-R_Marking_2.pdf> Vendor(s): Digikey: 311-120HRCT-ND <https://www.digikey.com/product-detail/en/yageo/RC0603FR-07120RL/311-120HRCT-ND/729867>; MANUFACTURER: Yageo; MPN: RC0603FR-07120RL; VENDOR: Digikey; VLINK: https://www.digikey.com/product-detail/en/yageo/RC0603FR-07120RL/311-120HRCT-ND/729867; VPN: 311-120HRCT-ND
R37 R38 = openag-resistors:10K-ERJ-3EKF1002V: RES SMD 10K OHM 1% 1/10W 0603 Description: 10 kOhms ±1% 0.1W, 1/10W Chip Resistor 0603 (1608 Metric) Automotive AEC-Q200 Thick Film Technical Specifications: Resistance: 10kOhms Tolerance: ±1% Power: 0.1W, 1/10W Operating Temperature: -55°C ~ 155°C Package/Case: 0603 (1608 Metric) Datasheet(s): ERJ-3EKF1002V View All Specifications <https://industrial.panasonic.com/ww/products/resistors/chip-resistors/general-purpose-chip-resistors/precision-thick-film-chip-resistors/ERJ3EKF1002V> Vendor(s): Digikey: P10.0KHCT-ND <https://www.digikey.com/product-detail/en/panasonic-electronic-components/ERJ-3EKF1002V/P10.0KHCT-ND/198102>; MANUFACTURER: Panasonic; MPN: ERJ-3EKF1002V; VENDOR: Digikey; VLINK: https://www.digikey.com/product-detail/en/panasonic-electronic-components/ERJ-3EKF1002V/P10.0KHCT-ND/198102; VPN: P10.0KHCT-ND
SJ1 SJ2 SJ5 SJ7-SJ10 = openag-connectors:EMI-BYPASS: EMI Bypass Solder Jumper; MPN: N/A
SJ_A0 SJ_A1-SJ_A5 SJ_A16 SJ_A17 = openag-connectors:SOLDERJUMPER: SMD Solder JUMPER Solder the two pads together to create a connection, or remove the solder to break it. REFLOW - Use this footprint for solder paste and reflow ovens. WAVE - Use this footprint for hand-soldering (larger pads). CLOSED - Has a trace between the two pads to ensure it is closed by default. The trace needs to be cut to disable the jumper, and can be closed again by creating a solder bridge between the two pads.; MPN: N/A
TP1-TP36 TP40-TP61 = openag-testpads:TP: Test pad
U1-U6 = openag-regulators:RCD-24-0.70/VREF: LED SUPPLY CC BUCK 2-35V 700MA Description: 700mA 2 ~ 35 V Constant Current LED Driver Buck Topology 1 Output Technical Specifications: Type: Constant Current Topology: Buck Number of Outputs: 1 Voltage - Input (Min): 4.5V Voltage - Input (Max): 36V Voltage - Output: 2 ~ 35 V Current - Output (Max): 700mA Power (Watts): 25W Dimming: Analog Features: SCP Operating Temperature: -40°C ~ 71°C Efficiency: 96% Mounting Type: Through Hole Package / Case: 6-DIP Module Size / Dimension: 0.87" L x 0.49" W x 0.33" H (22.1mm x 12.6mm x 8.5mm) Approvals: cULus Weight: 0.01 lb (4.54g) Datasheet(s): RCD-24 Series Datasheet <https://www.recom-power.com/pdf/Lightline/RCD-24.pdf> Vendor(s): Digikey: 945-1806-5-ND <https://www.digikey.com/product-detail/en/recom-power/RCD-24-0.70-VREF/945-1806-5-ND/2613767>; MANUFACTURER: Recom Power; MPN: RCD-24-0.70/VREF; VENDOR: Digikey; VLINK: https://www.digikey.com/product-detail/en/recom-power/RCD-24-0.70-VREF/945-1806-5-ND/2613767; VPN: 945-1806-5-ND
U7 = openag-dacs:DAC5578SPW: IC DAC 8BIT I2C OCTAL 16TSSOP Description: 8 Bit Digital to Analog Converter 8 16-TSSOP Technical Specifications: Number of Bits: 8 Number of D/A Converters: 8 Settling Time: 12µs (Typ) Output Type: Voltage - Buffered Differential Output: No Data Interface: I²C Reference Type: External Voltage - Supply, Analog: 2.7 V ~ 5.5 V Voltage - Supply, Digital: 2.7 V ~ 5.5 V INL/DNL (LSB): ±0.01, ±0.01 Architecture: String DAC Operating Temperature: -40°C ~ 125°C Package / Case: 16-TSSOP (0.173", 4.40mm Width) Supplier Device Package: 16-TSSOP Base Part Number: DAC5578 Datasheet(s): DAC5578,6578,7578 <http://www.ti.com/lit/ds/symlink/dac5578.pdf> Analog Signal Chain Guide <http://www.ti.com/lit/pdf/slyb174> Vendor(s): Digikey: 296-27736-5-ND <https://www.digikey.com/product-detail/en/texas-instruments/DAC5578SPW/296-27736-5-ND/2360827>; MANUFACTURER: Texas Instruments; MPN: DAC5578SPW; VENDOR: Digikey; VLINK: https://www.digikey.com/product-detail/en/texas-instruments/DAC5578SPW/296-27736-5-ND/2360827; VPN: 296-27736-5-ND
U8 = openag-microcontrollers:PSOC4100-CY8C4124PVI-432: IC MCU 32BIT 16KB FLASH 28SSOP Description: ARM® Cortex®-M0 PSOC® 4 CY8C41xx Microcontroller IC 32-Bit 24MHz 16KB (16K x 8) FLASH 28-SSOP Technical Specifications: Core Processor: ARM® Cortex®-M0 Core Size: 32-Bit Core Speed: 24 MHz Connectivity: I²C, IrDA, LIN, Microwire, SmartCard, SPI, SSP, UART/USART Peripherals: Brown-out Detect/Reset, LVD, POR, PWM, WDT Number of IO: 24 Program Memory Size: 16KB (16K x 8) Program Memory Type: FLASH RAM Size: 4K x 8 Supply Voltage: 1.71 V ~ 5.5 V Data Converters: A/D 8x12b Oscillator Type: Internal Operating Temperature: -40°C ~ 85°C (TA) Package / Case: 28-SSOP (0.209", 5.30mm Width) Datasheet(s): PSoC 4100 Family <http://www.cypress.com/file/138651/download> Vendor(s): Digikey: 428-3348-ND <https://www.digikey.com/product-detail/en/cypress-semiconductor-corp/CY8C4124PVI-432/428-3348-ND/4895074>; MANUFACTURER: Cypress; MPN: CY8C4124PVI-432; VENDOR: Digikey; VLINK: https://www.digikey.com/product-detail/en/cypress-semiconductor-corp/CY8C4124PVI-432/428-3348-ND/4895074; VPN: 428-3348-ND
U9 = openag-isolators:ADM2481BRWZ-RL7: DGTL ISO RS422/RS485 16SOIC Description: RS422, RS485 Digital Isolator 2500Vrms 3 Channel 500kbps 25kV/µs CMTI 16-SOIC (0.295", 7.50mm Width) Technical Specifications: Technology: Magnetic Coupling Type: RS422, RS485 Isolated Power: No Number of Channels: 3 Inputs - Side 1/Side 2: 2/1 Channel Type: Bidirectional Voltage - Isolation: 2500Vrms Common Mode Transient Immunity (Min): 25kV/µs Data Rate: 500kbps Rise / Fall Time (Typ): 600ns, 600ns (Max) Supply Voltage: 3.3 V ~ 5 V Operating Temperature: -40°C ~ 85°C Package / Case: 16-SOIC (0.295", 7.50mm Width) Datasheet(s): ADM2481 <http://www.analog.com/media/en/technical-documentation/data-sheets/ADM2481.pdf> Vendor(s): Digikey: ADM2481BRWZ-RL7TR-ND <https://www.digikey.com/product-detail/en/analog-devices-inc/ADM2481BRWZ-RL7/ADM2481BRWZ-RL7TR-ND/2606655>; MANUFACTURER: Analog Devices; MPN: ADM2481BRWZ-RL7; VENDOR: Digikey; VLINK: https://www.digikey.com/product-detail/en/analog-devices-inc/ADM2481BRWZ-RL7/ADM2481BRWZ-RL7TR-ND/2606655; VPN: ADM2481BRWZ-RL7TR-ND
U10 = openag-pwm:PCA9685PW/Q900-118: IC LED DRVR LIN DIM 25MA 28TSSOP Description: LED Driver IC 16 Output Linear PWM Dimming 25mA 28-TSSOP Technical Specifications: Type: Linear Internal Switch(s): Yes Number of Outputs: 16 Voltage - Supply (Min): 2.3V Voltage - Supply (Max): 5.5V Voltage - Output: 5.5V Current - Output / Channel: 25mA Dimming: PWM Applications: Backlight Operating Temperature: -40°C ~ 85°C (TA) Mounting Type: Surface Mount Package / Case: 28-TSSOP (0.173", 4.40mm Width) Supplier Device Package: 28-TSSOP Base Part Number: PCA9685 Datasheet(s): LED Controllers Leaflet <http://www.nxp.com/documents/leaflet/75016950.pdf> PCA9685 <https://www.nxp.com/docs/en/data-sheet/PCA9685.pdf> Vendor(s): Digikey: 568-5931-1-ND <https://www.digikey.com/product-detail/en/nxp-usa-inc/PCA9685PW-Q900118/568-5931-1-ND/2531218>; MANUFACTURER: NXP USA Inc.; MPN: PCA9685PW/Q900-118; VENDOR: Digikey; VLINK: https://www.digikey.com/product-detail/en/nxp-usa-inc/PCA9685PW-Q900118/568-5931-1-ND/2531218; VPN: 568-5931-1-ND
U11 U12 = openag-buffers:PCA9615DPJ: IC REDRIVER I2C 2CH 10TSSOP Description: Buffer, ReDriver 2 Channel 400kHz 10-TSSOP Technical Specifications: Type: Buffer, ReDriver Applications: I²C Input: 2-Wire Bus Output: 2-Wire Bus Data Rate (Max): 400kHz Number of Channels: 2 Capacitance - Input: 7pF Voltage - Supply: 2.3 V ~ 5.5 V Current - Supply: 16µA Operating Temperature: -40°C ~ 85°C Package / Case: 10-TFSOP, 10-MSOP (0.118", 3.00mm Width) Supplier Device Package: 10-TSSOP Base Part Number: PCA9615 Datasheet(s): PCA9615DP <http://www.nxp.com/documents/data_sheet/PCA9615.pdf> Vendor(s): Digikey: 568-11484-1-ND <https://www.digikey.com/product-detail/en/nxp-usa-inc/PCA9615DPJ/568-11484-1-ND/4864508>; MANUFACTURER: NXP USA Inc.; MPN: PCA9615DPJ; VENDOR: Digikey; VLINK: https://www.digikey.com/product-detail/en/nxp-usa-inc/PCA9615DPJ/568-11484-1-ND/4864508; VPN: 568-11484-1-ND
U13 = openag-regulators:LM2937IMP-3.3/NOPB: IC REG LIN 3.3V 400MA SOT223-4 Description: Linear Voltage Regulator IC Positive Fixed 1 Output 3.3V 400mA SOT-223-4 Technical Specifications: Output Configuration: Positive Output Type: Fixed Number of Regulators: 1 Voltage - Input (Max): 26V Voltage - Output (Min/Fixed): 3.3V Voltage Dropout (Max): 1V @ 50mA Current - Output: 400mA Current - Quiescent (Iq): 2mA Current - Supply (Max): 1.25A Protection Features: Over Temperature, Reverse Polarity, Short Circuit Operating Temperature: -40°C ~ 85°C Mounting Type: Surface Mount Package / Case: TO-261-4, TO-261AA Supplier Device Package: SOT-223-4 Base Part Number: LM2937 Datasheet(s): LM2937-2.5, LM2937-3.3 Datasheet <http://www.ti.com/lit/ds/symlink/lm2937-2.5.pdf> Vendor(s): Digikey: LM2937IMP-3.3/NOPBCT-ND <https://www.digikey.com/product-detail/en/texas-instruments/LM2937IMP-3.3-NOPB/LM2937IMP-3.3-NOPBCT-ND/270742#>; MANUFACTURER: Texas Instruments; MPN: LM2937IMP-3.3/NOPB; VENDOR: Digikey; VLINK: https://www.digikey.com/product-detail/en/texas-instruments/LM2937IMP-3.3-NOPB/LM2937IMP-3.3-NOPBCT-ND/270742#; VPN: LM2937IMP-3.3/NOPBCT-ND
U17 = openag-regulators:R-78E5.0-1.0: DC/DC CONVERTER 5V 5W Description: Linear Regulator Replacement DC DC Converter 1 Output 5V 1A 8V - 28V Input Technical Specifications: Type: Linear Regulator Replacement Number of Outputs: 1 Voltage - Input (Min): 8V Voltage - Input (Max): 28V Voltage - Output 1: 5V Current - Output (Max): 1A Power (Watts): 5W Applications: ITE (Commercial) Features: SCP Operating Temperature: -40°C ~ 85°C Efficiency: 91% Mounting Type: Through Hole Package / Case: 3-SIP Module Size / Dimension: 0.46" L x 0.33" W x 0.41" H (11.6mm x 8.5mm x 10.4mm) Datasheet(s): R-78E-1.0 Series Datasheet <https://www.recom-power.com/pdf/Innoline/R-78Exx-1.0.pdf> Vendor(s): Digikey: 945-2201-ND <https://www.digikey.com/product-detail/en/recom-power/R-78E5.0-1.0/945-2201-ND/4930585>; MANUFACTURER: Recom Power; MPN: R-78E5.0-1.0; VENDOR: Digikey; VLINK: https://www.digikey.com/product-detail/en/recom-power/R-78E5.0-1.0/945-2201-ND/4930585; VPN: 945-2201-ND
U$6 = openag-frames:AUTHOR; AUTHOR: Jake Rye; MPN: N/A
U$7 = openag-frames:TITLE; MPN: N/A; TITLE: Light Controller; URL: https://github.com/openaginitiative/openag_eagle/proj/light-controller; VER: 2.1